# EAGLE schematic DA14580_QFN40_0v5_P (EAGLE 6.5.0)
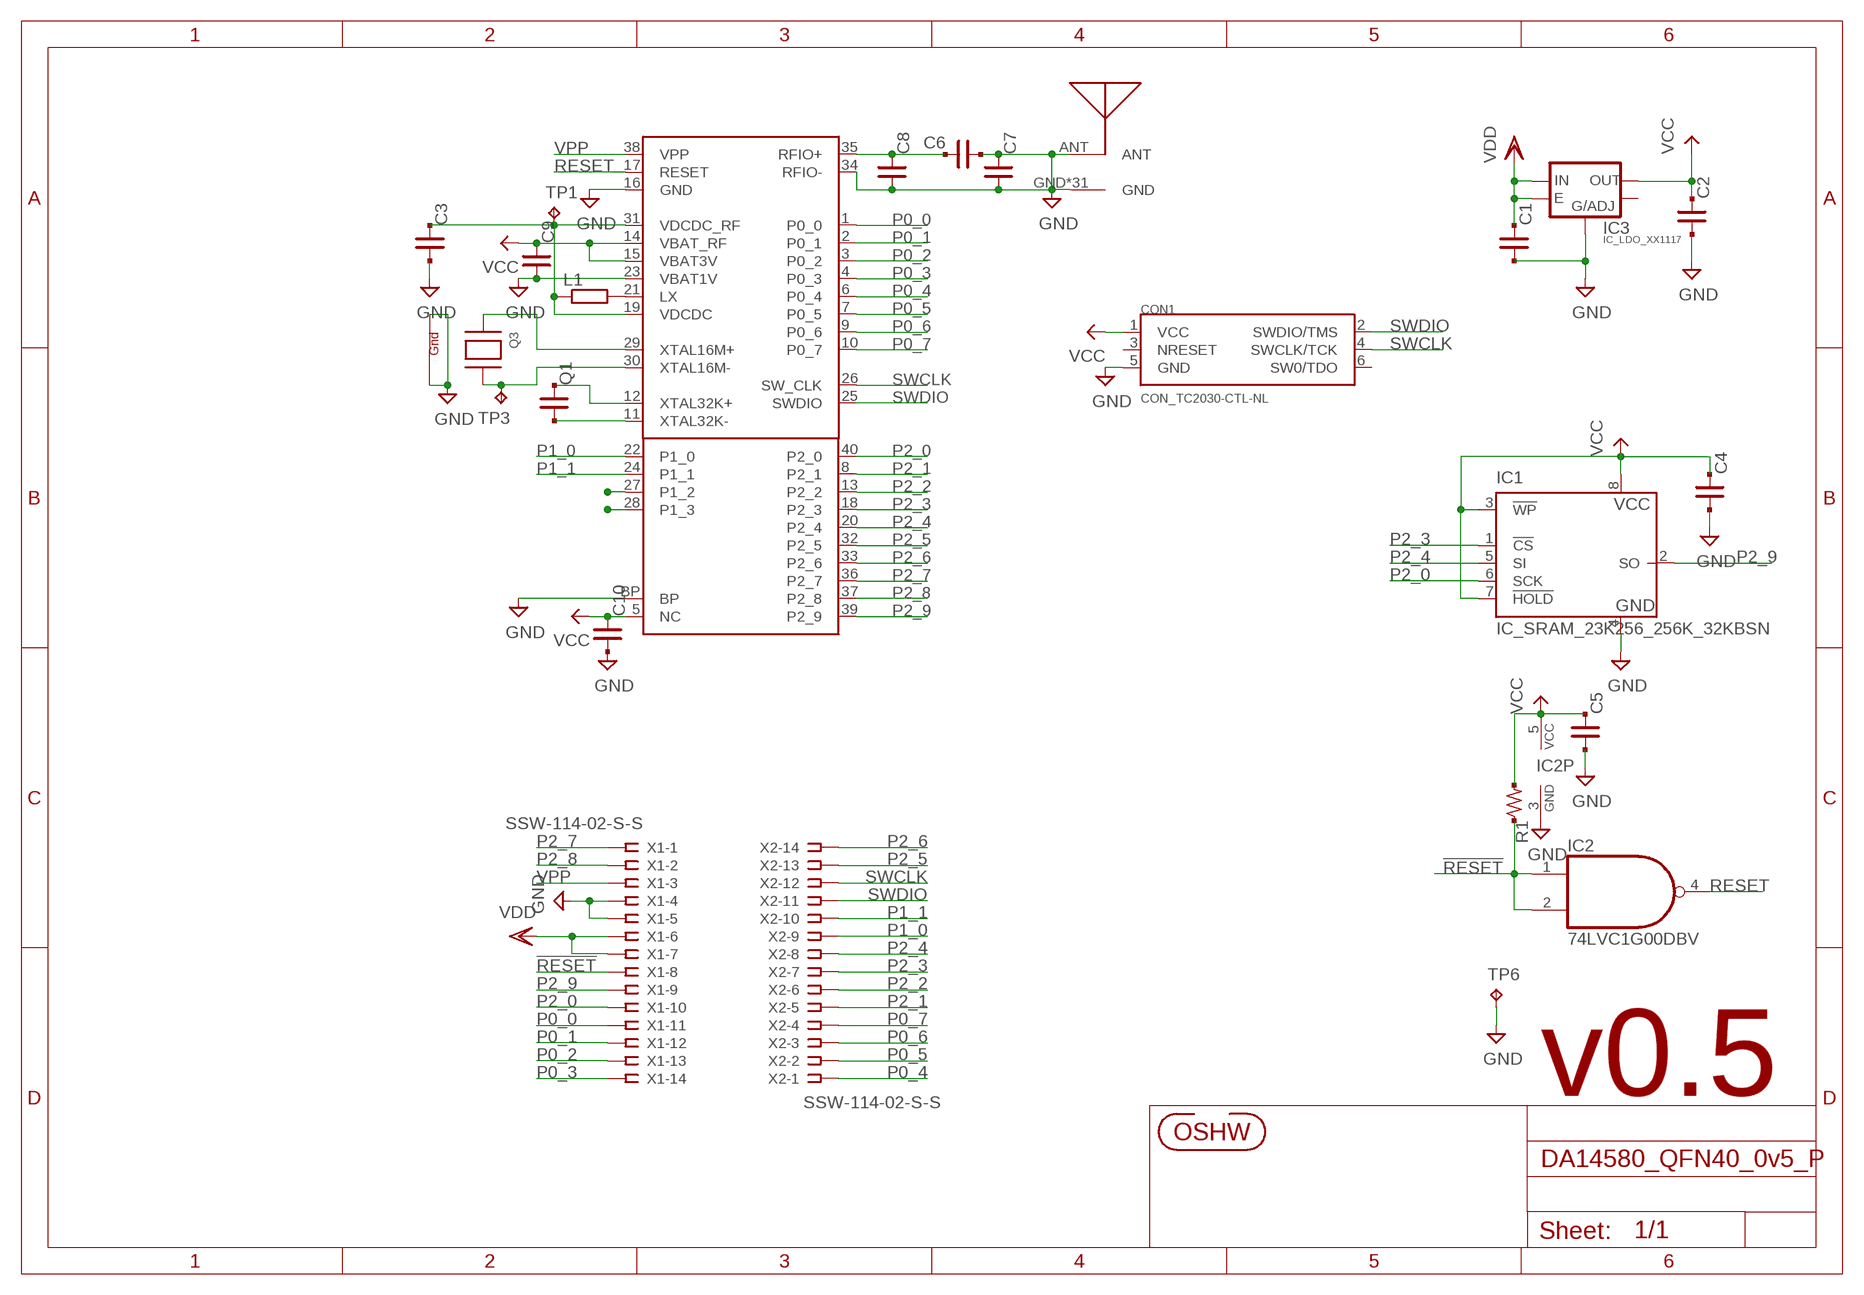
[diagram p0: schematic, sheet 1]

## Parts
C1  C_PAD_PAD_1005  [C0402]
C2  C_PAD_PAD_1005  [C0402]
C3  C_PAD_PAD_1005  [C0402]
C4  C_PAD_PAD_1005  [C0402]
C5  C_PAD_PAD_1005  [C0402]
C6  C_PAD_PAD_1005  [C0402]
C7  C_PAD_PAD_1005  [C0402]
C8  C_PAD_PAD_1005  [C0402]
C9  C_PAD_PAD_1005  [C0402]
C10  C_PAD_PAD_1005  [C0402]
CON1  CON_TC2030-CTL-NL  [CON_TC2030-IDC-NL]
IC1  IC_SRAM_23K256_256K_32KBSN  [IC_08_1.27_150MIL]
IC2  74LVC1G00DBV  [SOT23-5]
IC3  IC_LDO_XX1117  [IC_05_0.95_50MIL]
L1  R-EU_R0603  [R0603]
Q1  C_PAD_PAD_3216  [CR_3216]
Q3  XTAL-4-3225  [NX3225]
R1  R_US_PAD_PAD_1005  [C0402]
TP1  TPTP07R  [TP07R]
TP3  TPTP07R  [TP07R]
TP6  TPPAD1-13  [P1-13]
U1  IC_DA14580_QFN40  [QFN40_0.4P5.0X5.0]
U$1  ANT_IFA  [ANT_IFA_V2]
U$2  ICON_OSHW  [ICON_OSHW]
X1  SSW-114-02-S-S  [SSW-114-02-S-S]
X2  SSW-114-02-S-S  [SSW-114-02-S-S]

## Nets
!RESET!: IC2.1(I0) IC2.2(I1) R1.1 X1.8
GND: C1.2 C2.2 C3.2 C4.2 C5.2 C6.2 C7.1 C7.2 C8.2 C9.2 C10.2 CON1.5(GND) IC1.4(GND) IC2.3(GND) IC3.2(ADJ) Q3.2(G2) Q3.4(G1) TP6.TP U1.16(GND) U1.23(VBAT1V) U1.34(RFIO-) U1.BP U$1.ANT U$1.GND U$1.GND@1(GND) U$1.GND@2(GND) U$1.GND@3(GND) U$1.GND@4(GND) U$1.GND@5(GND) U$1.GND@6(GND) U$1.GND@7(GND) U$1.GND@8(GND) U$1.GND@9(GND) U$1.GND@10(GND) U$1.GND@11(GND) U$1.GND@12(GND) U$1.GND@13(GND) U$1.GND@14(GND) U$1.GND@15(GND) U$1.GND@16(GND) U$1.GND@17(GND) U$1.GND@18(GND) U$1.GND@19(GND) U$1.GND@20(GND) U$1.GND@21(GND) U$1.GND@22(GND) U$1.GND@23(GND) U$1.GND@24(GND) U$1.GND@25(GND) U$1.GND@26(GND) U$1.GND@27(GND) U$1.GND@28(GND) U$1.GND@29(GND) U$1.GND@30(GND) X1.4 X1.5
N$1: C6.1 C8.1 U1.35(RFIO+)
N$6: L1.2 U1.21(LX)
N$9: C3.1 L1.1 TP1.TP U1.19(VDCDC) U1.31(VDCDC_RF)
N$18: Q1.1 U1.12(XTAL32K+)
N$19: Q1.2 U1.11(XTAL32K-)
N$20: Q3.1(X1) U1.29(XTAL16M+)
N$21: Q3.3(X2) TP3.TP U1.30(XTAL16M-)
P0_0: U1.1(P0_0) X1.11
P0_1: U1.2(P0_1) X1.12
P0_2: U1.3(P0_2) X1.13
P0_3: U1.4(P0_3) X1.14
P0_4: U1.6(P0_4) X2.1
P0_5: U1.7(P0_5) X2.2
P0_6: U1.9(P0_6) X2.3
P0_7: U1.10(P0_7) X2.4
P1_0: U1.22(P1_0) X2.9
P1_1: U1.24(P1_1) X2.10
P1_2: U1.27(P1_2)
P1_3: U1.28(P1_3)
P2_0: IC1.6(SCK) U1.40(P2_0) X1.10
P2_1: U1.8(P2_1) X2.5
P2_2: U1.13(P2_2) X2.6
P2_3: IC1.1(!CS) U1.18(P2_3) X2.7
P2_4: IC1.5(SI) U1.20(P2_4) X2.8
P2_5: U1.32(P2_5) X2.13
P2_6: U1.33(P2_6) X2.14
P2_7: U1.36(P2_7) X1.1
P2_8: U1.37(P2_8) X1.2
P2_9: IC1.2(SO) U1.39(P2_9) X1.9
RESET: IC2.4(O) U1.17(RESET)
SWCLK: CON1.4(SWCLK/TCK) U1.26(SW_CLK) X2.12
SWDIO: CON1.2(SWDIO/TMS) U1.25(SWDIO) X2.11
VCC: C2.1 C4.1 C5.1 C9.1 C10.1 CON1.1(VCC) IC1.3(!WP) IC1.7(!HOLD) IC1.8(VCC) IC2.5(VCC) IC3.5(OUT) R1.2 U1.5(NC) U1.14(VBAT_RF) U1.15(VBAT3V)
VDD: C1.1 IC3.1(IN) IC3.3(E) X1.6 X1.7
VPP [power]: U1.38(VPP) X1.3
Unconnected: CON1.3(NRESET) CON1.6(SW0/TDO) IC3.4(OUT)

## Notes on the sheet
- v0.5

## Library data of the parts
C1-C10 Q1 = mylib:C_PAD_PAD_: SMD CAPACITOR : PAD - PAD
CON1 = mylib:CON_TC2030
IC1 = mylib:IC_SRAM_23K256_256K_32KB
IC2 = 74xx-little-us_local:74*1G00: 2-input NAND gate
IC3 = mylib:IC_LDO_XX1117
L1 = rcl:R-EU_: RESISTOR, European symbol
Q3 = adafruit (1):XTAL-4: Classic 4-pin 3.2 x 2.5mm crystal
R1 = mylib:R_US_PAD_PAD: R_US_PAD_PAD : SMD R PAD is NTH-NTH Packages : _1608 : 1.6 x 0.8 mm _2125 : 2.0 x 1.25 mm _3216 : 3.2 x 1.6 mm
TP1 TP3 TP6 = testpad_local:TP: Test pad
U1 = mylib:IC_DA14580_QFN40
U$1 = mylib:ANT_IFA
U$2 = mylib:ICON_OSHW
X1 X2 = con-samtec.local:SSW-114-02-S-S: THROUGH-HOLE .025" SQ POST SOCKET Source: Samtec SSW.pdf; MPN: SSW-114-02-S-S; OC_FARNELL: unknown; OC_NEWARK: 11P9549

## Net classes
0 signal: width 0.15 mm, drill 0.3 mm, clearance 0.15 mm
1 power: width 0.15 mm, drill 0.3 mm, clearance 0.15 mm